# Altium schematic sheet stabilizator nap..SchDoc
size A4; SheetNumber: 6; SheetTotal: 7
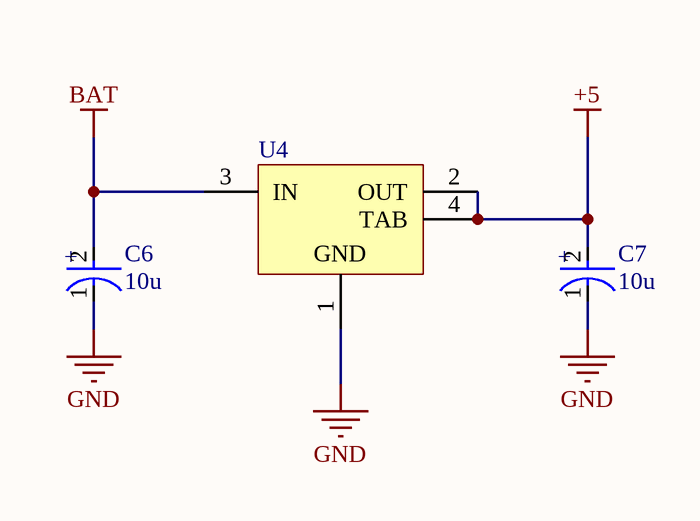
[diagram p0: stabilizator nap..SchDoc]

## Parts
C6  10u  [FP-TAJP-MFG]
C7  10u  [FP-TAJP-MFG]
U4  LM1117MPX-5.0/NOPB  [DCY0004A_L]  (value not drawn)

## Nets
+5: C7.2(A) U4.2(OUT) U4.4(TAB)
BAT: C6.2(A) U4.3(IN)
GND: C6.1(C) C7.1(C) U4.1(GND)

## Notes on the sheet
- (in symbol CMP-2007-04028-2) +

## Library data of the parts
C6 C7 = CMP-2007-04028-2: 10uF 10V  ±20% 6Ω 0805  SMD Tantalum Capacitor; Dissipation Factor: 8%; ESR (Equivalent Series Resistance): 6R; Polarity: Polar; Leakage Current: 1uA; Height: 1.5mm; Packaging: Tape and Reel; Max Operating Temperature: 125°C; Lead Free: Lead Free; Length: 2.05mm; RoHS Compliant: Yes; Number of Pins: 2; Case Code (Metric): 2012; Series: TAJ; Height - Seated (Max): 0.059inch; Mount: Surface Mount; REACH SVHC: No SVHC; Depth: 1.35mm; Tolerance: 20%; Case Code (Imperial): 0805; Dielectric Material: Tantalum; Features: General Purpose; Voltage: 10V; Capacitance: 10uF; Package Quantity: 1; Case/Package: 0805; Voltage Rating (DC): 10V; Termination: SMD/SMT; Width: 0.053inch; Min Operating Temperature: -55°C; Voltage Rating: 10V
U4 = CMP-0062-01635-4: 800mA Low-Dropout Linear Regulator, 4-pin SOT-223, Pb-Free; Manufacturer: Texas Instruments; PowerWise: N; High-Reliability: Y; PackageTopMarking: XYTT*N06A; CompType: LDO IC; PartNumber: LM1117MPX-5.0/NOPB; Code_JEDEC: TO-261-AA; Code_IPC: SOT223-4; ComponentLink1URL: http://www.ti.com/general/docs/lit/getliterature.tsp?genericPartNumber=LM1117-N&fileType=pdf; PinCount: 4; PackageReference: DCY0004A; ComponentLink1Description: Datasheet URL; PackageDescription: Molded SOT-223, 6.50 x 3.56 x 1.6mm Body, 4 Lead, 2.3mm Pitch; RoHS: Y